# EAGLE schematic avr-grundschaltung (EAGLE 4.16)
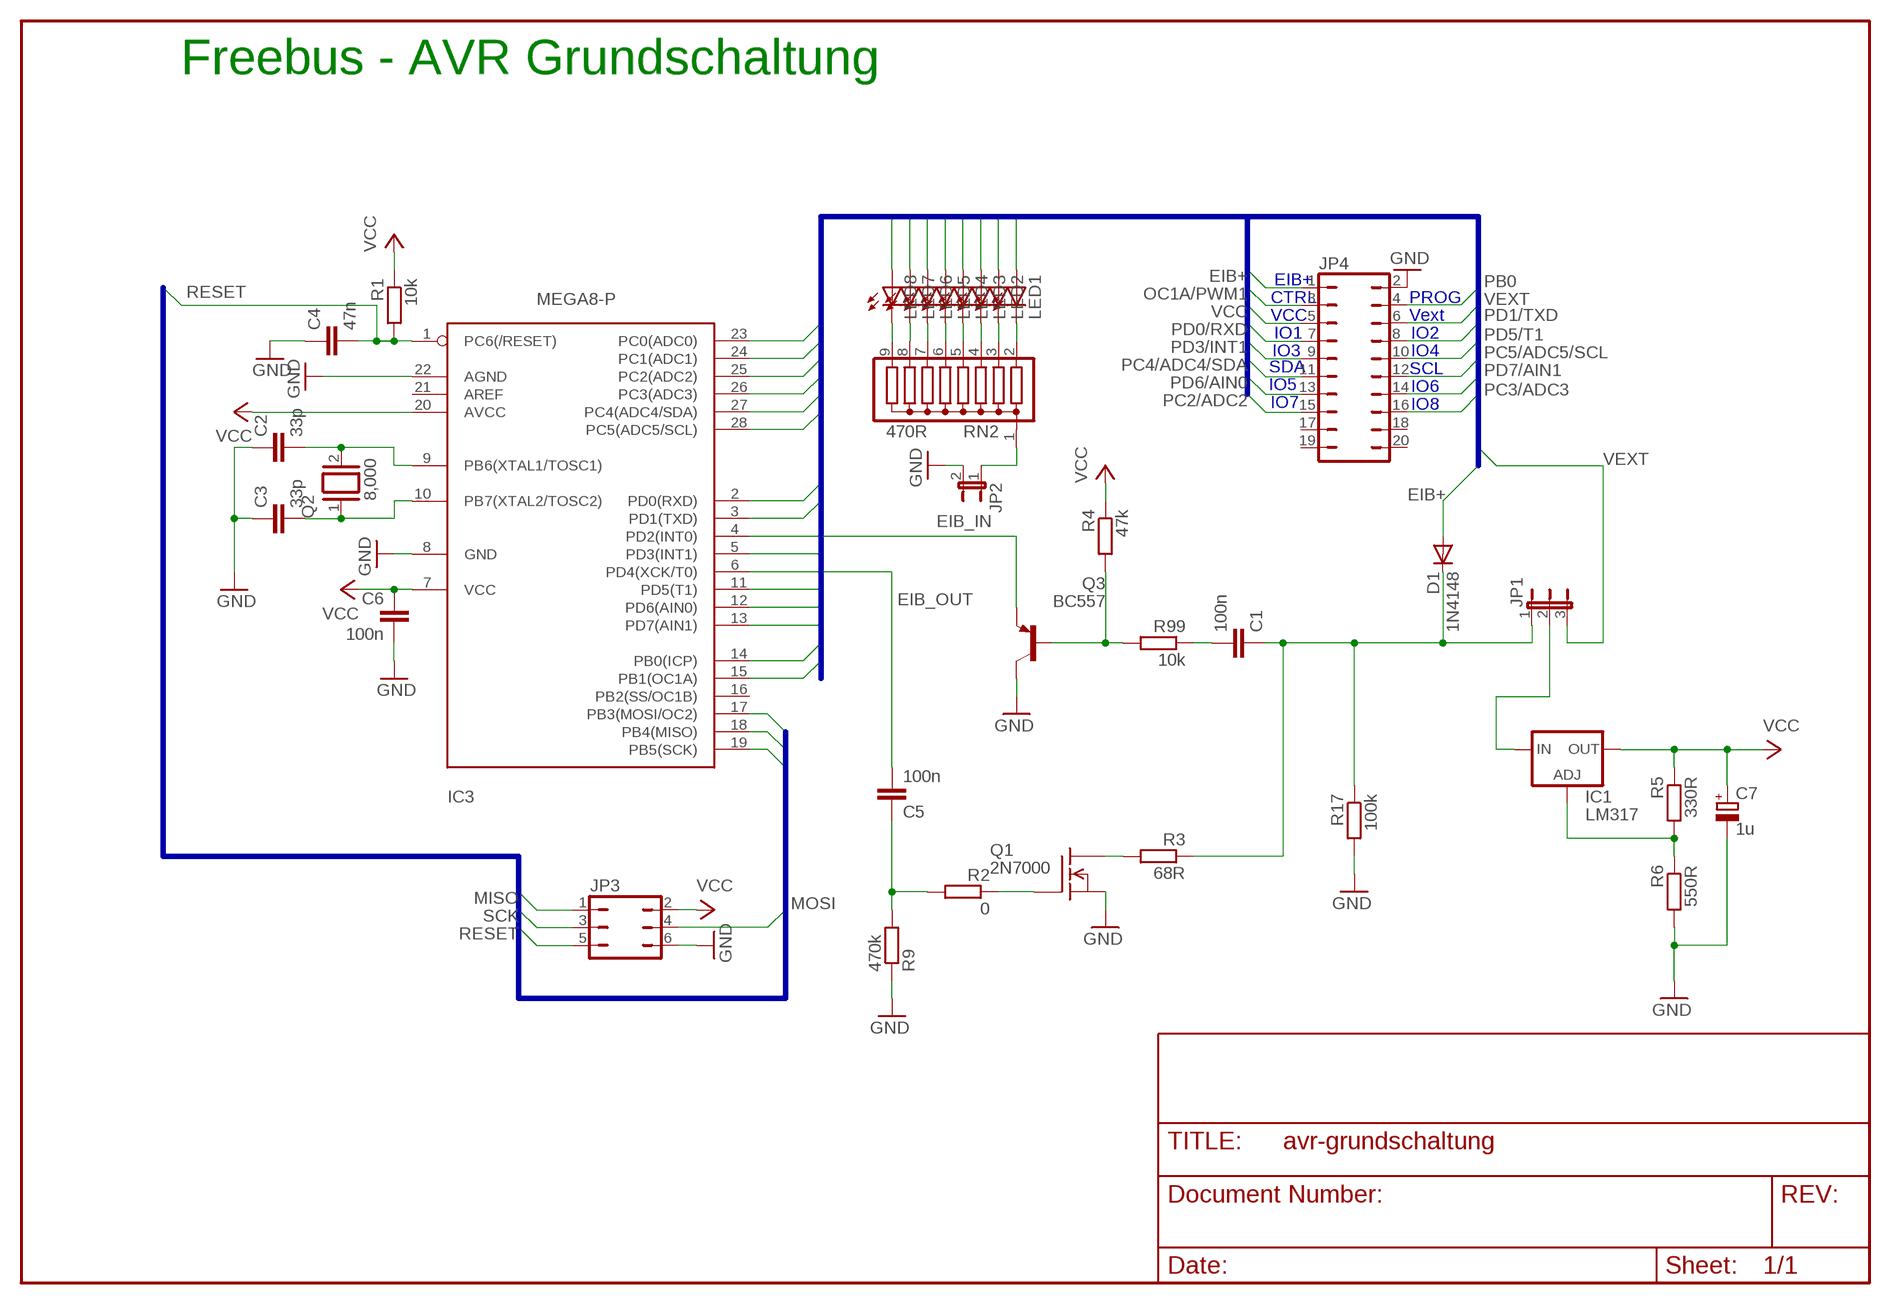
[diagram p0: schematic, sheet 1]

## Parts
C1  100n  C-EU050-025X075  [C050-025X075]
C2  33p  C-EU025-025X050  [C025-025X050]
C3  33p  C-EU025-025X050  [C025-025X050]
C4  47n  C-EU050-024X044  [C050-024X044]
C5  100n  C-EU050-025X075  [C050-025X075]
C6  100n  C-EU050-025X075  [C050-025X075]
C7  1u  CPOL-EUE2-5  [E2-5]
D1  1N4148  [DO35-10]
IC1  LM317  LM317L  [317L]
IC3  MEGA8-P  [DIL28-3]
JP1  JP2E  [JP2]
JP2  JP1E  [JP1]
JP3  JP3Q  [JP3Q]
JP4  JP10Q  [JP10Q]
LED1  LED3MM  [LED3MM]
LED2  LED3MM  [LED3MM]
LED3  LED3MM  [LED3MM]
LED4  LED3MM  [LED3MM]
LED5  LED3MM  [LED3MM]
LED6  LED3MM  [LED3MM]
LED7  LED3MM  [LED3MM]
LED8  LED3MM  [LED3MM]
Q1  2N7000  VN2222KM  [TO237]
Q2  8,000  XTAL/S  [QS]
Q3  BC557  [TO92]
R1  10k  R-EU_0207/10  [0207/10]
R2  0  R-EU_0207/10  [0207/10]
R3  68R  R-EU_0207/10  [0207/10]
R4  47k  R-EU_0207/10  [0207/10]
R5  330R  R-EU_0207/10  [0207/10]
R6  550R  R-EU_0207/10  [0207/10]
R9  470k  R-EU_0207/10  [0207/10]
R17  100k  R-EU_0207/10  [0207/10]
R99  10k  R-EU_0207/10  [0207/10]
RN2  470R  G08R  [SIL9]

## Nets
EIB+: D1.A JP4.1
EIB_IN: IC3.4(PD2(INT0)) Q3.1(E)
EIB_OUT: C5.2 IC3.6(PD4(XCK/T0))
GND: C2.1 C3.1 C4.1 C6.2 C7.- IC3.8(GND) IC3.22(AGND) JP2.2 JP3.6 JP4.2 Q1.3(S) Q3.3(C) R6.2 R9.1 R17.2
MISO: IC3.18(PB4(MISO)) JP3.1
MOSI: IC3.17(PB3(MOSI/OC2)) JP3.4
N$1 [supply]: C1.2 R99.1
N$2: IC1.1(ADJ) R5.2 R6.1
N$3 [supply]: C1.1 D1.C JP1.1 R3.1 R17.1
N$4: LED8.K(C) RN2.9
N$5 [supply]: Q1.1(D) R3.2
N$6 [supply]: IC1.3(IN) JP1.2
N$7 [supply]: Q3.2(B) R4.2 R99.2
N$8: C2.2 IC3.9(PB6(XTAL1/TOSC1)) Q2.2
N$9: C3.2 IC3.10(PB7(XTAL2/TOSC2)) Q2.1
N$10: LED7.K(C) RN2.8
N$11: LED6.K(C) RN2.7
N$12: C5.1 R2.2 R9.2
N$13: LED5.K(C) RN2.6
N$14: LED4.K(C) RN2.5
N$15: LED3.K(C) RN2.4
N$16: LED2.K(C) RN2.3
N$17: LED1.K(C) RN2.2
N$18: JP2.1 RN2.1
N$23: Q1.2(G) R2.1
OC1A/PWM1: IC3.15(PB1(OC1A)) JP4.3
PB0: IC3.14(PB0(ICP)) JP4.4
PC0/ADC0: IC3.23(PC0(ADC0))
PC1/ADC1: IC3.24(PC1(ADC1))
PC2/ADC2: IC3.25(PC2(ADC2)) JP4.15 LED7.A
PC3/ADC3: IC3.26(PC3(ADC3)) JP4.16 LED8.A
PC4/ADC4/SDA: IC3.27(PC4(ADC4/SDA)) JP4.11
PC5/ADC5/SCL: IC3.28(PC5(ADC5/SCL)) JP4.12
PD0/RXD: IC3.2(PD0(RXD)) JP4.7 LED1.A
PD1/TXD: IC3.3(PD1(TXD)) JP4.8 LED2.A
PD3/INT1: IC3.5(PD3(INT1)) JP4.9 LED3.A
PD5/T1: IC3.11(PD5(T1)) JP4.10 LED4.A
PD6/AIN0: IC3.12(PD6(AIN0)) JP4.13 LED5.A
PD7/AIN1: IC3.13(PD7(AIN1)) JP4.14 LED6.A
RESET: C4.2 IC3.1(PC6(/RESET)) JP3.5 R1.2
SCK: IC3.19(PB5(SCK)) JP3.3
VCC: C6.1 C7.+ IC1.2(OUT) IC3.7(VCC) IC3.20(AVCC) JP3.2 JP4.5 R1.1 R4.1 R5.1
VEXT [supply]: JP1.3 JP4.6
Unconnected: IC3.16(PB2(SS/OC1B)) IC3.21(AREF) JP4.17 JP4.18 JP4.19 JP4.20

## Buses
PC0/ADC0,PC1/ADC1,PC2/ADC2,PC3/ADC3,PC4/ADC4/SDA,PC5/ADC5/SCL,PD0/RXD,PD1/TXD,EIB+,OC1A/PWM1,OC1B/PWM2,VEXT,PB0,VCC,PD3/INT1,PD5/T1,PD6/AIN0,PD7/AIN1
MOSI,MISO,SCK,RESET

## Notes on the sheet
- Freebus - AVR Grundschaltung
- EIB+
- CTRL | PROG
- VCC | Vext
- IO1 | IO2
- IO3 | IO4
- SDA | SCL
- IO5 | IO6
- IO7 | IO8

## Library data of the parts
C1-C6 = rcl:C-EU: CAPACITOR, European symbol
C7 = rcl:CPOL-EU: POLARIZED CAPACITOR, European symbol
D1 = diode:1N4148: DIODE high speed (Philips)
IC1 = v-reg:LM317L: VOLTAGE REGULATOR
IC3 = atmel:MEGA8-P: MICROCONTROLLER 8 Kbytes FLASH 1 kbytes SRAM 512 bytes EEPROM USART 4-channel 10 bit ADC 2-channel 8 bit ADC Source: avr.lbr
JP1 = jumper:JP2E: JUMPER
JP2 = jumper:JP1E: JUMPER
JP3 = jumper:JP3Q: JUMPER
JP4 = jumper:JP10Q: JUMPER
LED1-LED8 = led:LED: LED OSRAM: - CHIPLED LG R971, LG N971, LY N971, LG Q971, LY Q971, LO R971, LY R971 LH N974, LH R974 LS Q976, LO Q976, LY Q976 LO Q996 - Hyper CHIPLED LW Q18S LB Q993, LB Q99A, LB R99A - SideLED LS A670, LO A670, LY A670, LG A670, LP A670 LB A673, LV A673, LT A673, LW A673 LH A674 LY A675 LS A676, LA A676, LO A676, LY A676, LW A676 LS A679, LY A679, LG A679 - Hyper Micro SIDELED® LS Y876, LA Y876, LO Y876, LY Y876 LT Y87S - SmartLED LW L88C, LW L88S LB L89C, LB L89S, LG L890 LS L89K, LO L89K, LY L89K LS L896, LA L896, LO L896, LY L896 - TOPLED LS T670, LO T670, LY T670, LG T670, LP T670 LSG T670, LSP T670, LSY T670, LOP T670, LYG T670 LG T671, LOG T671, LSG T671 LB T673, LV T673, LT T673, LW T673 LH T674 LS T676, LA T676, LO T676, LY T676, LB T676, LH T676, LSB T676, LW T676 LB T67C, LV T67C, LT T67C, LS T67K, LO T67K, LY T67K, LW E67C LS E67B, LA E67B, LO E67B, LY E67B, LB E67C, LV E67C, LT E67C LW T67C LS T679, LY T679, LG T679 LS T770, LO T770, LY T770, LG T770, LP T770 LB T773, LV T773, LT T773, LW T773 LH T774 LS E675, LA E675, LY E675, LS T675 LS T776, LA T776, LO T776, LY T776, LB T776 LHGB T686 LT T68C, LB T68C - Hyper Mini TOPLED® LB M676 - Mini TOPLED Santana® LG M470 LS M47K, LO M47K, LY M47K Source: http://www.osram.convergy.de - LUMILED® LXK2-PW12-R00, LXK2-PW12-S00, LXK2-PW14-U00, LXK2-PW14-V00 LXK2-PM12-R00, LXK2-PM12-S00, LXK2-PM14-U00 LXK2-PE12-Q00, LXK2-PE12-R00, LXK2-PE12-S00, LXK2-PE14-T00, LXK2-PE14-U00 LXK2-PB12-K00, LXK2-PB12-L00, LXK2-PB12-M00, LXK2-PB14-N00, LXK2-PB14-P00, LXK2-PB14-Q00 LXK2-PR12-L00, LXK2-PR12-M00, LXK2-PR14-Q00, LXK2-PR14-R00 LXK2-PD12-Q00, LXK2-PD12-R00, LXK2-PD12-S00 LXK2-PH12-R00, LXK2-PH12-S00 LXK2-PL12-P00, LXK2-PL12-Q00, LXK2-PL12-R00 Source: www.luxeon.com
Q1 = transistor-fet:VN2222KM: N-Channel Enhancement MOSFET (VMOS); 60V; 0,5A; 7,5Ohm
Q2 = special:XTAL/S: CRYSTAL
Q3 = transistor-pnp:BC557: PNP Transistor
R1-R6 R9 R17 R99 = rcl:R-EU_: RESISTOR, European symbol
RN2 = resistor-sil:G08R: SIL RESISTOR